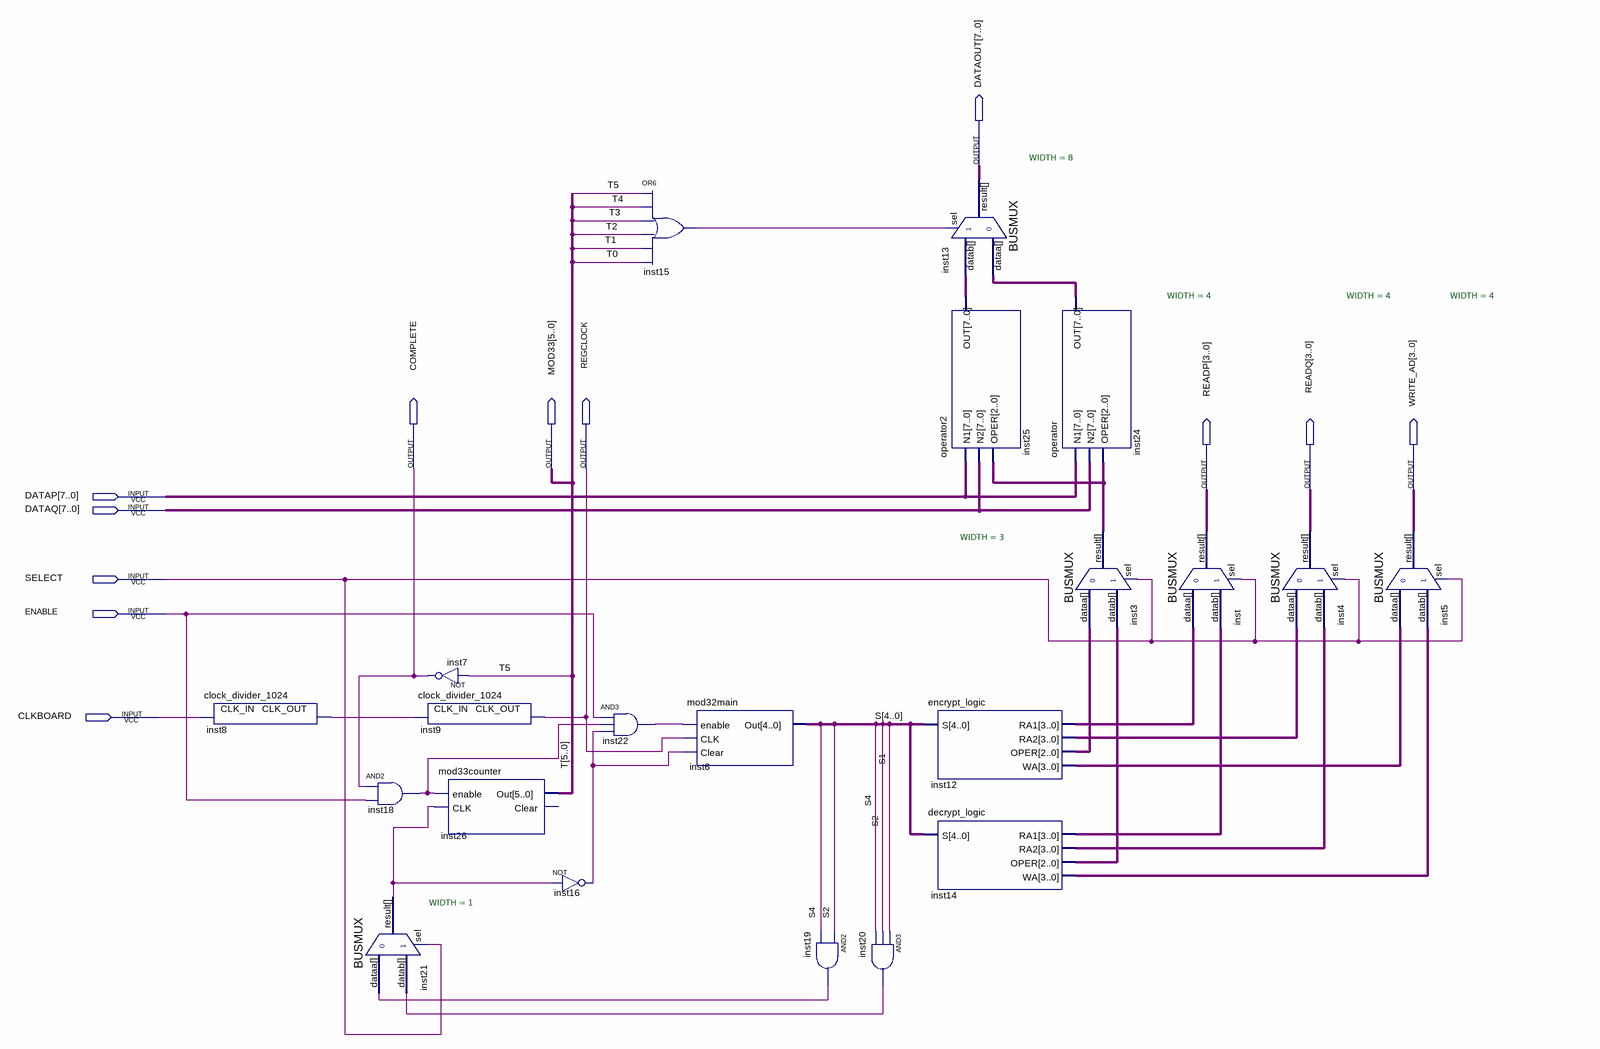
[diagram p0: schematic sheet]
// Quartus schematic ALU.bdf as structural Verilog: 21 symbols, 12 pins
module ALU (
  input  [7:0] DATAP,
  input  [7:0] DATAQ,
  input  SELECT,
  input  ENABLE,
  input  CLKBOARD,
  output [7:0] DATAOUT,
  output COMPLETE,
  output [5:0] MOD33,
  output REGCLOCK,
  output [3:0] READP,
  output [3:0] READQ,
  output [3:0] WRITE_AD
);

  wire inst8_clk_out, inst15_out, inst16_out, inst18_out, inst19_out, inst20_out, inst21_result, inst22_out;
  wire [2:0] inst3_result, inst12_oper, inst14_oper;
  wire [3:0] inst12_ra1, inst12_ra2, inst12_wa, inst14_ra1, inst14_ra2, inst14_wa;
  wire [4:0] S;
  wire [7:0] inst24_out, inst25_out;

  clock_divider_1024 inst8 (.CLK_IN(CLKBOARD), .CLK_OUT(inst8_clk_out));
  and inst18 (inst18_out, COMPLETE, ENABLE);
  BUSMUX #(.WIDTH(1)) inst21 (.datab(inst20_out), .sel(SELECT), .dataa(inst19_out), .result(inst21_result));
  not inst7 (COMPLETE, MOD33[5]);
  clock_divider_1024 inst9 (.CLK_IN(inst8_clk_out), .CLK_OUT(REGCLOCK));
  mod33counter inst26 (.enable(inst18_out), .CLK(inst21_result), .Out(MOD33));  // open: Clear
  not inst16 (inst16_out, inst21_result);
  and inst22 (inst22_out, ENABLE, inst18_out, inst16_out);
  or inst15 (inst15_out, MOD33[5], MOD33[4], MOD33[3], MOD33[2], MOD33[1], MOD33[0]);
  mod32main inst6 (.enable(inst22_out), .CLK(REGCLOCK), .Clear(inst16_out), .Out(S));
  and inst19 (inst19_out, S[2], S[4]);
  and inst20 (inst20_out, S[1], S[2], S[4]);
  BUSMUX #(.WIDTH(8)) inst13 (.datab(inst25_out), .sel(inst15_out), .dataa(inst24_out), .result(DATAOUT));
  operator2 inst25 (.N1(DATAP), .N2(DATAQ), .OPER(inst3_result), .OUT(inst25_out));
  encrypt_logic inst12 (.S(S), .RA1(inst12_ra1), .RA2(inst12_ra2), .OPER(inst12_oper), .WA(inst12_wa));
  decrypt_logic inst14 (.S(S), .RA1(inst14_ra1), .RA2(inst14_ra2), .OPER(inst14_oper), .WA(inst14_wa));
  operator inst24 (.N1(DATAP), .N2(DATAQ), .OPER(inst3_result), .OUT(inst24_out));
  BUSMUX #(.WIDTH(3)) inst3 (.datab(inst14_oper), .sel(SELECT), .dataa(inst12_oper), .result(inst3_result));
  BUSMUX #(.WIDTH(4)) inst (.datab(inst14_ra1), .sel(SELECT), .dataa(inst12_ra1), .result(READP));
  BUSMUX #(.WIDTH(4)) inst4 (.datab(inst14_ra2), .sel(SELECT), .dataa(inst12_ra2), .result(READQ));
  BUSMUX #(.WIDTH(4)) inst5 (.datab(inst14_wa), .sel(SELECT), .dataa(inst12_wa), .result(WRITE_AD));

  // Other names for the same wires on the sheet: T[5:0] = MOD33; T0 = MOD33[0]; T1 = MOD33[1]; T2 = MOD33[2];
  //   T3 = MOD33[3]; T4 = MOD33[4]; T5 = MOD33[5]
endmodule
